# EAGLE design Motee (EAGLE 8.4.1)
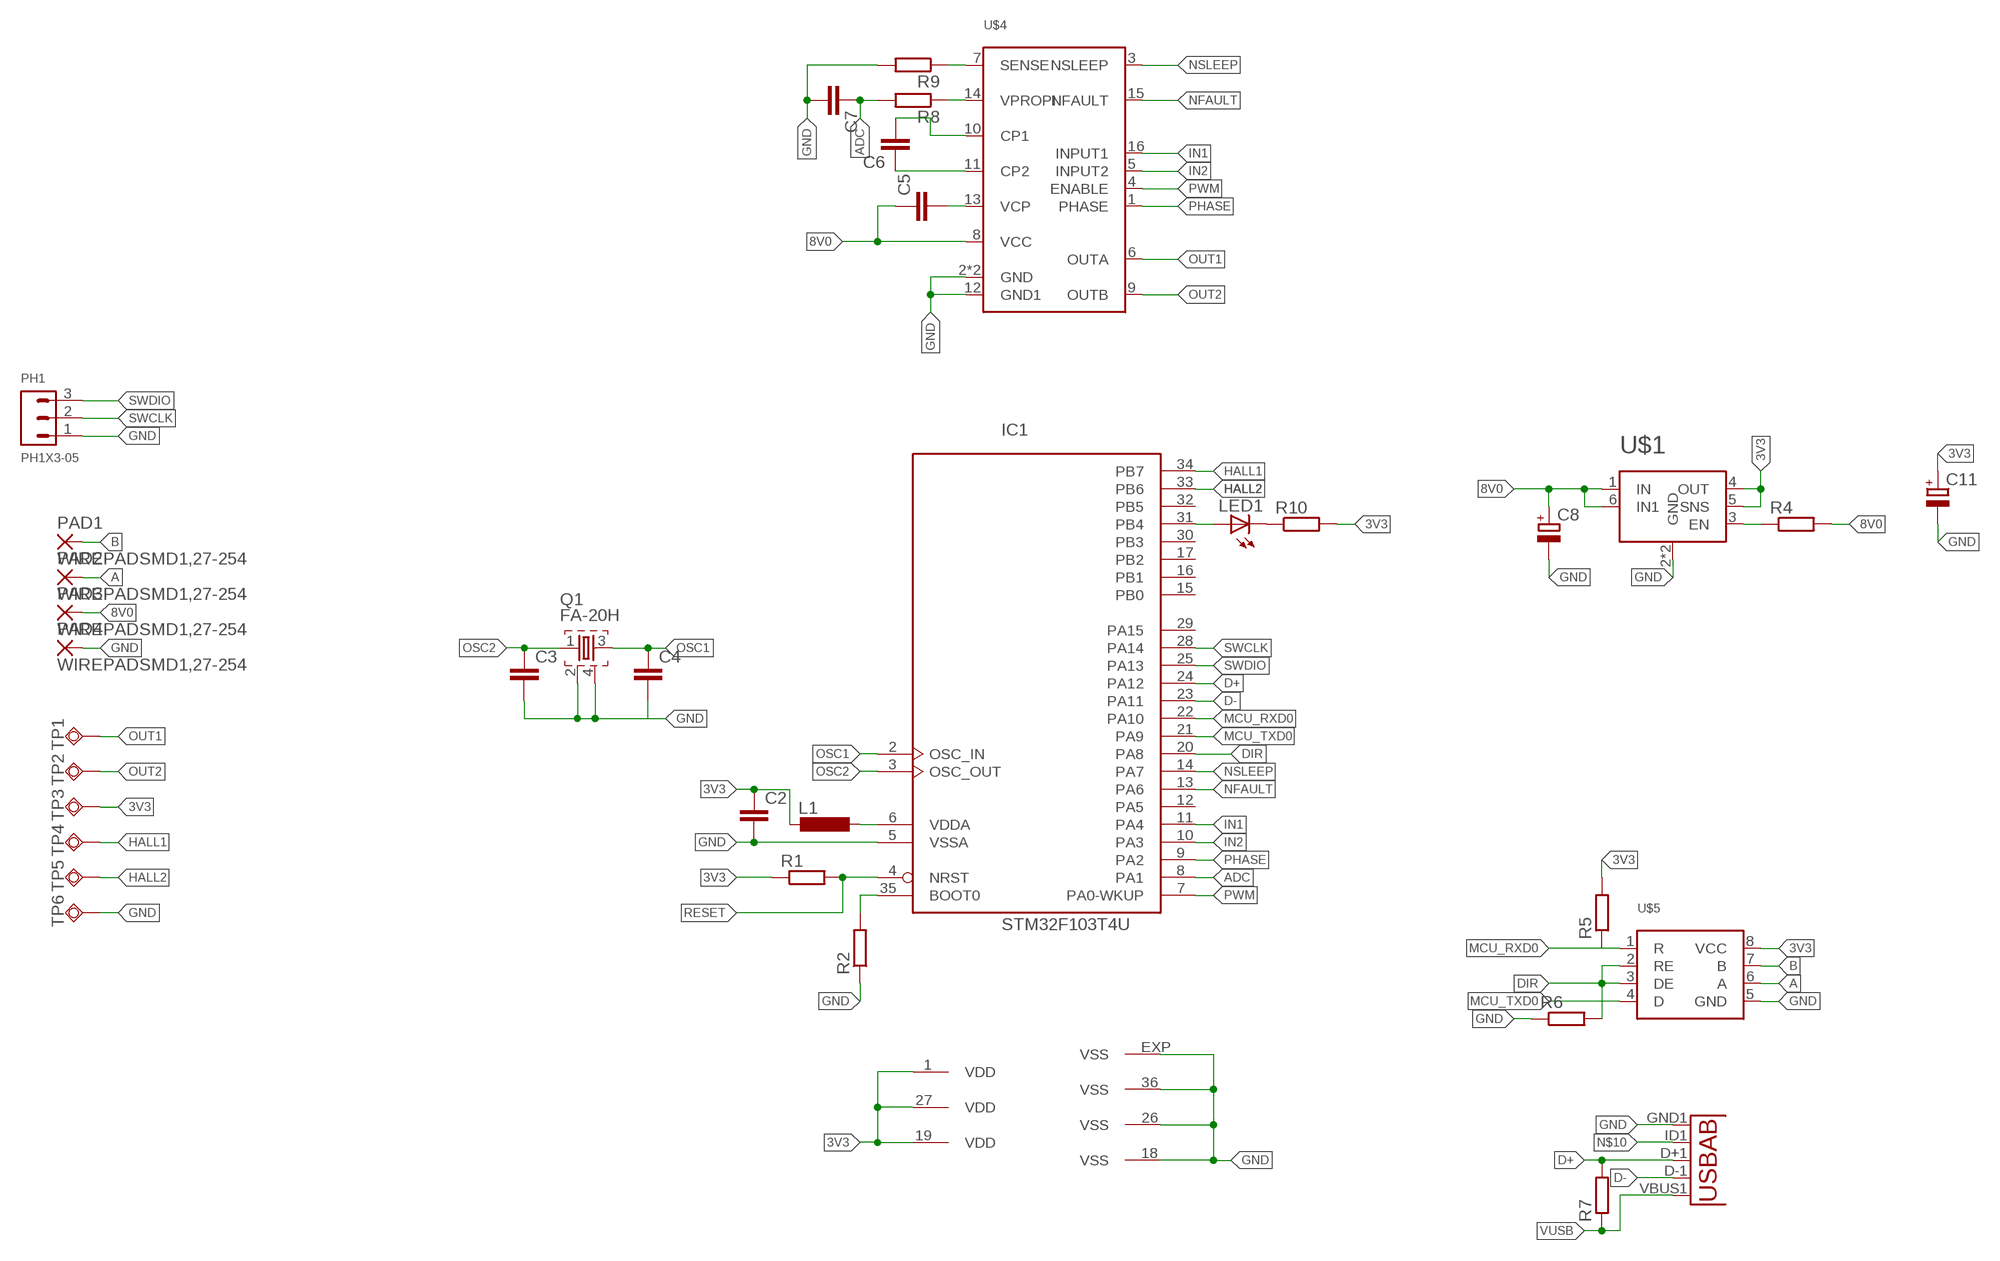
[diagram p0: schematic, sheet 1]

## Parts
C2  C-EUC0402K  [C0402K]
C3  C-EUC0402K  [C0402K]
C4  C-EUC0402K  [C0402K]
C5  C-EUC0402K  [C0402K]
C6  C-EUC0402K  [C0402K]
C7  C-EUC0402K  [C0402K]
C8  CPOL-EUB/3528-21R  [B/3528-21R]
C11  CPOL-EUB/3528-21R  [B/3528-21R]
IC1  STM32F103T4U  [VFQFPN36]
L1  L-EUL2012C  [L2012C]
LED1  LEDCHIP-LED0603  [CHIP-LED0603]
PAD1  WIREPADSMD1,27-254  [SMD1,27-2,54]
PAD2  WIREPADSMD1,27-254  [SMD1,27-2,54]
PAD3  WIREPADSMD1,27-254  [SMD1,27-2,54]
PAD4  WIREPADSMD1,27-254  [SMD1,27-2,54]
PH1  PH1X3-05  [PH005-1-3]
Q1  FA-20H  [FA-20H]
R1  R-EU_R0402  [R0402]
R2  R-EU_R0402  [R0402]
R4  R-EU_R0402  [R0402]
R5  R-EU_R0402  [R0402]
R6  R-EU_R0402  [R0402]
R7  R-EU_R0402  [R0402]
R8  R-EU_R0402  [R0402]
R9  R-EU_R0402  [R0402]
R10  R-EU_R0402  [R0402]
TP1  TPSQTP20SQ  [TP20SQ]
TP2  TPSQTP20SQ  [TP20SQ]
TP3  TPSQTP20SQ  [TP20SQ]
TP4  TPSQTP20SQ  [TP20SQ]
TP5  TPSQTP20SQ  [TP20SQ]
TP6  TPSQTP20SQ  [TP20SQ]
U1  USB""  [USB-MICRO-SMD]
U$1  LP38693  [LP38693]
U$4  DRV8801  [WQFN-16]
U$5  MAX22501EATA  [TDFN-8]

## Nets
3V3: C2.1 C11.+ IC1.1(VDD) IC1.19(VDD) IC1.27(VDD) L1.2 R1.1 R5.2 R10.2 TP3.TP U$1.4(OUT) U$1.5(SNS) U$5.8(VCC)
8V0: C5.1 C8.+ PAD3.1(P) R4.2 U$1.1(IN) U$1.6(IN1) U$4.8(VCC)
A: PAD2.1(P) U$5.6(A)
ADC: C7.1 IC1.8(PA1) R8.2
B: PAD1.1(P) U$5.7(B)
D+: IC1.24(PA12) R7.2 U1.D+1(D+)
D-: IC1.23(PA11) U1.D-1(D-)
DIR: IC1.20(PA8) R6.2 U$5.2(RE) U$5.3(DE)
GND: C2.2 C3.2 C4.2 C7.2 C8.- C11.- IC1.5(VSSA) IC1.18(VSS) IC1.26(VSS) IC1.36(VSS) IC1.EXP(VSS) PAD4.1(P) PH1.1 Q1.2 Q1.4 R2.1 R6.1 R9.2 TP6.TP U1.GND1(GND) U$1.2(GND) U$1.7(GND) U$4.2(GND) U$4.12(GND1) U$4.17(GND) U$5.5(GND)
HALL1: IC1.34(PB7) TP4.TP
HALL2: IC1.33(PB6) TP5.TP
IN1: IC1.11(PA4) U$4.16(INPUT1)
IN2: IC1.10(PA3) U$4.5(INPUT2)
MCU_RXD0: IC1.22(PA10) R5.1 U$5.1(R)
MCU_TXD0: IC1.21(PA9) U$5.4(D)
N$1: IC1.35(BOOT0) R2.2
N$2: IC1.6(VDDA) L1.1
N$3: C6.1 U$4.11(CP2)
N$4: C5.2 U$4.13(VCP)
N$8: C6.2 U$4.10(CP1)
N$9: R4.1 U$1.3(EN)
N$10: U1.ID1(USBID)
N$11: R8.1 U$4.14(VPROPI)
N$12: R9.1 U$4.7(SENSE)
N$13: LED1.C R10.1
N$17: IC1.31(PB4) LED1.A
NFAULT: IC1.13(PA6) U$4.15(NFAULT)
NSLEEP: IC1.14(PA7) U$4.3(NSLEEP)
OSC1: C4.1 IC1.2(OSC_IN) Q1.3
OSC2: C3.1 IC1.3(OSC_OUT) Q1.1
OUT1: TP1.TP U$4.6(OUTA)
OUT2: TP2.TP U$4.9(OUTB)
PHASE: IC1.9(PA2) U$4.1(PHASE)
PWM: IC1.7(PA0-WKUP) U$4.4(ENABLE)
RESET: IC1.4(NRST) R1.2
SWCLK: IC1.28(PA14) PH1.2
SWDIO: IC1.25(PA13) PH1.3
VUSB: R7.1 U1.VBUS1(VBUS)
Unconnected: IC1.12(PA5) IC1.15(PB0) IC1.16(PB1) IC1.17(PB2) IC1.29(PA15) IC1.30(PB3) IC1.32(PB5)

## Library data of the parts
C2-C7 = rcl:C-EU: CAPACITOR, European symbol
C8 C11 = rcl:CPOL-EU: POLARIZED CAPACITOR, European symbol
IC1 = micro-stm_v3:STM32F103T*U: ARM 32-bit Cortex™-M3 CPU 72 MHz maximum frequency 16 to 128 Kbytes of Flash memory 6 to 20 kbytes of SRAM 26 GPIOs 2.0 to 3.6 V application supply
L1 = rcl:L-EU: INDUCTOR, European symbol
LED1 = led:LED: LED OSRAM: - CHIPLED LG R971, LG N971, LY N971, LG Q971, LY Q971, LO R971, LY R971 LH N974, LH R974 LS Q976, LO Q976, LY Q976 LO Q996 - Hyper CHIPLED LW Q18S LB Q993, LB Q99A, LB R99A - SideLED LS A670, LO A670, LY A670, LG A670, LP A670 LB A673, LV A673, LT A673, LW A673 LH A674 LY A675 LS A676, LA A676, LO A676, LY A676, LW A676 LS A679, LY A679, LG A679 - Hyper Micro SIDELED® LS Y876, LA Y876, LO Y876, LY Y876 LT Y87S - SmartLED LW L88C, LW L88S LB L89C, LB L89S, LG L890 LS L89K, LO L89K, LY L89K LS L896, LA L896, LO L896, LY L896 - TOPLED LS T670, LO T670, LY T670, LG T670, LP T670 LSG T670, LSP T670, LSY T670, LOP T670, LYG T670 LG T671, LOG T671, LSG T671 LB T673, LV T673, LT T673, LW T673 LH T674 LS T676, LA T676, LO T676, LY T676, LB T676, LH T676, LSB T676, LW T676 LB T67C, LV T67C, LT T67C, LS T67K, LO T67K, LY T67K, LW E67C LS E67B, LA E67B, LO E67B, LY E67B, LB E67C, LV E67C, LT E67C LW T67C LS T679, LY T679, LG T679 LS T770, LO T770, LY T770, LG T770, LP T770 LB T773, LV T773, LT T773, LW T773 LH T774 LS E675, LA E675, LY E675, LS T675 LS T776, LA T776, LO T776, LY T776, LB T776 LHGB T686 LT T68C, LB T68C - Hyper Mini TOPLED® LB M676 - Mini TOPLED Santana® LG M470 LS M47K, LO M47K, LY M47K Source: http://www.osram.convergy.de LUXEON: - LUMILED® LXK2-PW12-R00, LXK2-PW12-S00, LXK2-PW14-U00, LXK2-PW14-V00 LXK2-PM12-R00, LXK2-PM12-S00, LXK2-PM14-U00 LXK2-PE12-Q00, LXK2-PE12-R00, LXK2-PE12-S00, LXK2-PE14-T00, LXK2-PE14-U00 LXK2-PB12-K00, LXK2-PB12-L00, LXK2-PB12-M00, LXK2-PB14-N00, LXK2-PB14-P00, LXK2-PB14-Q00 LXK2-PR12-L00, LXK2-PR12-M00, LXK2-PR14-Q00, LXK2-PR14-R00 LXK2-PD12-Q00, LXK2-PD12-R00, LXK2-PD12-S00 LXK2-PH12-R00, LXK2-PH12-S00 LXK2-PL12-P00, LXK2-PL12-Q00, LXK2-PL12-R00 Source: www.luxeon.com KINGBRIGHT: KA-3528ASYC Source: www.kingbright.com
PAD1-PAD4 = wirepad:WIREPAD: Wire PAD connect wire on PCB
PH1 = pinhead_1mm:PH1X3
Q1 = crystal:FA-: MHz RANGE CRYSTAL UNIT Source: Epson Toyocom
R1 R2 R4-R10 = rcl:R-EU_: RESISTOR, European symbol
TP1-TP6 = testpad:TPSQ: Test pad
U1 = microusb2:USB: This is a USB AB connector that is compatible with USB OTG. i.e. this connector can serve as a host or device
U$1 = LP38963:LP38693
U$4 = drv8801:DRV8801
U$5 = MAX22501EATA:MAX22501EATA

## Board
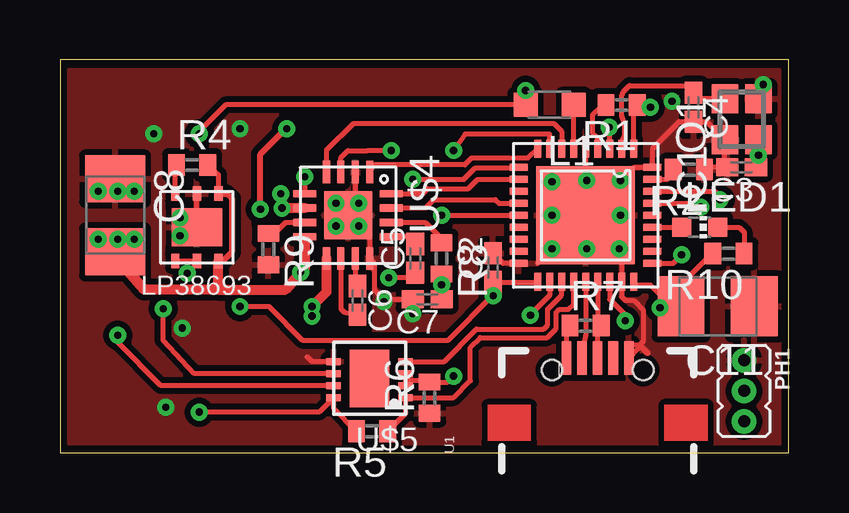
[diagram p1: board, top side]
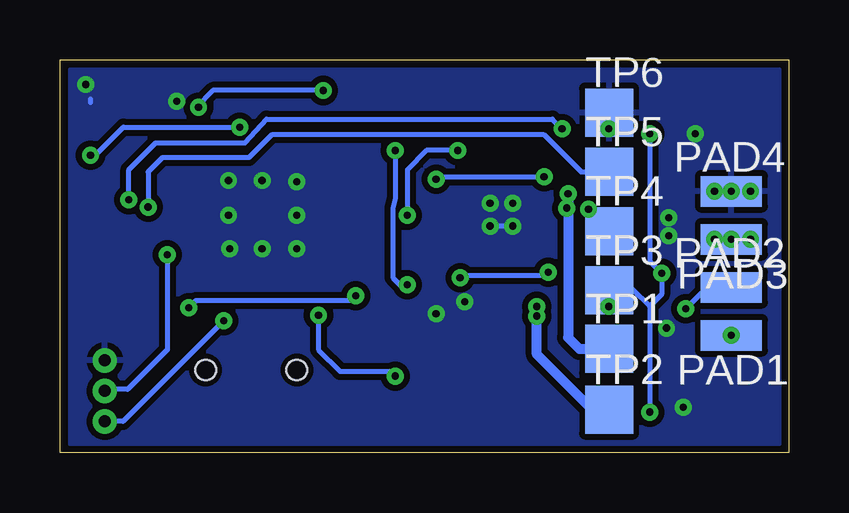
[diagram p2: board, bottom side, seen from below]

Size 30.37 x 16.37 mm. Coordinates in mm from the lower left corner, seen from the top.
Outline: 0,0 30.37,0 30.37,16.37 0,16.37 0,0
Copper layers (1*16): Top 0.035mm / dielectric 1.5mm / Bottom 0.035mm
Design rules "default *": minimum track width 6mil, minimum drill 0.35mm, track to track 6mil, track to pad 5mil, pad to pad 5mil, via to via 0mil, smd to smd 0mil, copper to edge 0mil, drill to drill 6mil, minimum pad ring 10mil, minimum via ring 8mil, stop-mask expansion 4mil, vias tented up to drill 0mil, thermal gap 10mil

### Footprints (pad centres in the part's own frame; a part is rotated, then mirrored left to right if it is on the bottom)
C0402K = smd 0.925 x 0.74: 1 -0.6,0; 2 0.6,0
B/3528-21R = smd 1.95 x 2.5: + 1.525,0; - -1.525,0
VFQFPN36 = smd 0.75 x 0.3: 1 -2.78,2; 2 -2.78,1.5; 3 -2.78,1; 4 -2.78,0.5; 5 -2.78,0; 6 -2.78,-0.5; 7 -2.78,-1; 8 -2.78,-1.5; 9 -2.78,-2; 19 2.78,-2; 20 2.78,-1.5; 21 2.78,-1; 22 2.78,-0.5; 23 2.78,0; 24 2.78,0.5; 25 2.78,1; 26 2.78,1.5; 27 2.78,2 | smd 0.3 x 0.75: 10 -2,-2.78; 11 -1.5,-2.78; 12 -1,-2.78; 13 -0.5,-2.78; 14 0,-2.78; 15 0.5,-2.78; 16 1,-2.78; 17 1.5,-2.78; 18 2,-2.78; 28 2,2.78; 29 1.5,2.78; 30 1,2.78; 31 0.5,2.78; 32 0,2.78; 33 -0.5,2.78; 34 -1,2.78; 35 -1.5,2.78; 36 -2,2.78 | smd 4.1 x 4.1: EXP 0,0
L2012C = smd 1 x 1: 1 -1,0; 2 1,0
CHIP-LED0603 = smd 0.8 x 0.8: A 0,-0.75; C 0,0.75
SMD1,27-2,54 = smd 1.27 x 2.54: 1 0,0
PH005-1-3 = drill 0.5 pad 0.9: 1 0,0; 2 1.27,0; 3 2.54,0
FA-20H = smd 1.2 x 1.1: 1 -0.85,-0.7; 2 0.85,-0.7; 3 0.85,0.7; 4 -0.85,0.7
R0402 = smd 0.7 x 0.9: 1 -0.65,0; 2 0.65,0
TP20SQ = smd 2 x 2: TP 0,0
USB-MICRO-SMD = smd 1.4 x 0.4: D+1 2.7,0; D-1 2.7,0.65; GND1 2.7,-1.3; ID1 2.7,-0.65; VBUS1 2.7,1.3 | hole 0.85: 2.2,1.9; 2.2,-1.9
LP38693 = smd 0.35 x 0.6: 1 -0.9,-1.4; 2 0,-1.4; 3 0.9,-1.4; 4 0.9,1.4; 5 0,1.4; 6 -0.9,1.4 | smd 2.1 x 1.6: 7 0,0
WQFN-16 = smd 0.95 x 0.3: 1 -1.8,0.9; 2 -1.8,0.3; 3 -1.8,-0.3; 4 -1.8,-0.9; 9 1.8,-0.9; 10 1.8,-0.3; 11 1.8,0.3; 12 1.8,0.9 | smd 0.3 x 0.95: 5 -0.9,-1.8; 6 -0.3,-1.8; 7 0.3,-1.8; 8 0.9,-1.8; 13 0.9,1.8; 14 0.3,1.8; 15 -0.3,1.8; 16 -0.9,1.8 | smd 2 x 2: 17 0,0
TDFN-8 = smd 0.61 x 0.305: 1 -1.5,0.8; 2 -1.5,0.3; 3 -1.5,-0.2; 4 -1.5,-0.7; 5 1.5,-0.7; 6 1.5,-0.2; 7 1.5,0.3; 8 1.5,0.8 | smd 1.64 x 2.38: P$1 0,0

### Placement (x,y rotation side)
C2  18.04,7.72 90 top
C3  28.4,11.9 180 top
C4  26.4,14.4 270 top
C5  14.8,8.1 90 top
C6  12.4,6.35 270 top
C7  15.3,6.4 180 top
C8  2.3,9.9 270 top
C11  27.4,6.1 180 top
IC1  21.9,9.9 270 top
L1  20.4,14.5 180 top
LED1  26.65,9.4 270 top
PAD1  2.4,4.9 90 bottom
PAD2  2.4,6.9 270 bottom
PAD3  2.4,8.9 90 bottom
PAD4  2.4,10.9 270 bottom
PH1  28.5,3.85 270 top
Q1  28.4,13.9 90 top
R1  23.4,14.5 180 top
R2  26.2,11.8 180 top
R4  5.5,12 0 top
R5  13,0.9 180 top
R6  15.4,2.3 90 top
R7  21.9,5.3 0 top
R8  15.9,8.1 270 top
R9  8.68,8.49 270 top
R10  27.85,8.3 180 top
TP1  7.49,4.33 0 bottom
TP2  7.49,1.8 0 bottom
TP3  7.49,6.77 0 bottom
TP4  7.49,9.24 0 bottom
TP5  7.49,11.71 0 bottom
TP6  7.49,14.18 0 bottom
U1  22.4,1.25 90 top
U$1  5.7,9.4 180 top
U$4  12,9.9 270 top
U$5  12.9,3.1 180 top

### Tracks (layer width: path | path; a pad name or v marks a point on that pad's centre or on a via)
3V3  (via drill 0.3)
  Top 0.2: R5.2 11.4,1.85 U$5.8 10.8,1.7 v5.8,1.7 | U$1.4 U$1.5 5.7,7.88 v5.3,7.48 | L1.2 6.9,14.5 5.8,13.4 v5.8,13.3 | 8.65,6.1 8.7,6.1 10.1,4.7 16.18,4.7 v18.04,6.56
  Top 0.203: IC1.1 23.9,14.25 R1.1 v24.6,14.4 | v19.4,15.1 L1.2 | IC1.27 24.02,7 24.6,7 25.5,6.1 C11.+ | R10.2 27.15,8.3 26.25,7.4 26.25,6.48 C11.+ | C11.+ 24.85,6.1 v25,6.05 | IC1.19 C2.1 v18.04,6.56 v18.05,6.55 | v7.5,6.1 8.65,6.1
  Bottom 0.2: 5.8,6.1 v5.8,1.7 | 5.8,6.1 6.5,6.8 7.46,6.8 TP3.TP | 5.8,6.1 5.3,6.6 v5.3,7.48 5.8,7.98 v5.8,13.3
  Bottom 0.203: v19.4,15.1 24,15.1 24.7,14.4 v24.6,14.4 | TP3.TP v7.49,6.11 v7.5,6.1 | v25,6.05 24.7,6.35 18.3,6.35 18.05,6.6 v18.05,6.55
8V0  (via drill 0.3)
  Top 0.203: C5.1 14.6,7.3 v13.7,7.3 | U$1.1 6.6,11.6 6.55,11.6 R4.2
  Top 0.254: U$1.6 6.8,8 7.15,8.35 7.15,10.6 6.95,10.8 U$1.1
  Top 0.305: U$4.8 10.2,8.8
  Top 0.406: v1.6,8.9 1.77,8.9 C8.+ 2.3,8.2 3.5,6.8 6.6,6.8 | PAD3.1 v3.1,8.9 | 6.6,6.8 9.4,6.8 v10.03,7.53 10.2,7.7 10.2,8.8 | 6.6,6.8 U$1.6
  Bottom 0.203: v13.7,7.3 13.6,7.4 10.2,7.4 10.2,7.53 v10.03,7.53
  Bottom 0.406: v1.6,8.9 PAD3.1
  other vias: 2.4,8.9
A  (via drill 0.3)
  Top 0.2: U$5.6 5.6,3.3 4.3,4.7 v4.3,6
  Bottom 0.2: v4.3,6 3.4,6.9 PAD2.1
ADC  (via drill 0.3)
  Top 0.203: C7.1 v15.9,7 R8.2 | 16.29,12.51 16.5,12.6 v16.4,12.6 16.88,13.28 20.4,13.28 IC1.8
  Bottom 0.203: v16.4,12.6 16.4,10.6 16.5,10.2 16.5,7.3 16.1,6.9 16,6.9 v15.9,7
B  (via drill 0.3)
  Top 0.2: U$5.7 4.2,2.8 2.4,4.6 PAD1.1
  other vias: 2.4,4.9
D+
  Top 0.203: U1.D+1 22.4,5.25 22.52,5.38 | 22.52,5.38 R7.2 | IC1.24 22.4,5.5 22.52,5.38
D-
  Top 0.203: IC1.23 21.9,4.9 21.8,4.5 21.8,4.15 U1.D-1
DIR  (via drill 0.3)
  Top 0.2: 14.4,3 U$5.2 | 14.4,3 U$5.3 | IC1.20 20.4,6.57 19.53,5.7 19.6,5.7 19.63,5.73 v19.6,5.73 | 14.4,3 15.35,3 R6.2 16.15,2.95 v16.4,3.2
  Bottom 0.2: v19.6,5.73 19.6,4.3 18.7,3.4 16.6,3.4 v16.4,3.2
GND  (via drill 0.3)
  Top 0.2: U$5.5 10.5,3.8 10.3,4
  Top 0.203: 22,10 IC1.EXP | 22,10 23.9,11.9 IC1.36 24.7,11.92 24.7,12.7 25.8,13.8 C4.2 26.95,13.8 Q1.4 27.7,11.9 | R2.1 26.95,11.9 27.7,11.9 | 27.7,11.9 C3.2 | 19.9,7.9 IC1.EXP | 22,10 23.4,8.6 IC1.26 23.4,6.5 23.55,6.35 23.9,6.35 24.3,5.95 24.3,4.65 24.15,4.5 | IC1.EXP IC1.5 | U$4.17 v12.45,9.45 12.9,9 U$4.12 13.1,7.9 13.1,6.8 13.5,6.4 C7.2 | 5.7,9.5 U$1.7 | 5.7,9.5 U$1.2 | 6.62,9.02 6.6,9 6.2,9 5.7,9.5 | U$4.17 v11.5,10.4 11.35,10.55 | U$4.17 11.8,9.9 v11.5,9.45 | U$4.17 12.3,10.2 v12.45,10.4 12.3,10.55 U$4.2 | 24.15,4.5 24.5,4.15 24.45,4.15 24.25,4.35 24.1,4.35 U1.GND1 23.7,4.45 23.65,4.5 24.15,4.5 | C2.2 18.46,7.9 IC1.18
  Top 0.406: v1.6,10.9 PAD4.1
  Bottom 0.203: Q1.2 29.1,14.6 | 11.45,9.55 v11.5,9.45 v12.45,9.45
  Bottom 0.406: v3.1,10.9 PAD4.1 v1.6,10.9
  other vias: 2.4,10.9 14.7,5.8 13.5,6.3 5,9.8 5,9.05 20.5,11.3 20.5,8.5 23.3,8.5 23.35,11.35 20.5,9.9 21.95,11.35 23.35,9.9 21.95,8.5 7.5,13.5 25.5,14.65 29.3,15.35 5.1,5.2 3.9,13.3 4.4,1.9
  pour Top (isolate 0.254): 0.4,15.95 29.95,15.95 29.95,0.4 0.4,0.4
  pour Bottom (isolate 0.254): 0.4,15.95 29.95,15.95 29.95,0.4 0.4,0.4
HALL1  (via drill 0.3)
  Top 0.203: IC1.34 27.3,10.9 27.55,10.55 v27.5,10.55 | 9.35,13.6 9.28,13.53 9.42,13.51 v9.45,13.5
  Top 0.254: v8.35,10.15 8.35,12.44 9.42,13.51
  Bottom 0.203: v27.5,10.55 27.5,11.8 26.39,12.91 22.65,12.91 21.76,13.91 9.86,13.91 v9.45,13.5 | v8.35,10.15 7.49,9.49 TP4.TP
HALL2  (via drill 0.3)
  Top 0.203: IC1.33 26.65,10.4 26.7,10.35 v26.7,10.24
  Bottom 0.2: 10.2,13.25 21.55,13.25 22.5,12.3 26.1,12.3 26.69,11.71 26.69,10.26
  Bottom 0.203: v26.7,10.24 26.69,10.26 26.65,10.39 | 10.2,13.25 8.66,11.71 TP5.TP
IN1
  Top 0.203: IC1.11 17.4,11.4 17.01,11.01 15.32,11.01 15.11,10.8 U$4.16
IN2  (via drill 0.3)
  Top 0.203: IC1.10 19,11.88 17.31,11.88 16.83,11.4 v14.7,11.4 | v10.2,11.5 U$4.5
  Bottom 0.203: v14.7,11.4 14.6,11.5 v10.2,11.5
MCU_RXD0
  Top 0.2: IC1.22 21.4,6.2 21.18,5.98 20.81,5.98 20.67,5.84 20.67,5.17 20.3,4.8 17.5,4.8 17.1,4.4 17.1,3 16.4,2.3 U$5.1 14.4,1.65 R5.1
MCU_TXD0
  Top 0.2: U$5.4 16,3.8 17.35,5.15 20.15,5.15 20.32,5.32 20.32,5.99 20.9,6.57 IC1.21
N$1
  Top 0.203: IC1.35 25.3,11.4 25.55,11.65 R2.2
N$2
  Top 0.203: IC1.6 L1.1
N$3
  Top 0.203: U$4.11 12.3,6.9 C6.1
N$4
  Top 0.203: C5.2 14.5,9 U$4.13
N$8
  Top 0.203: U$4.10 11.7,6 11.85,5.85 C6.2
N$9
  Top 0.203: U$1.3 4.8,11.95 R4.1
N$11
  Top 0.203: U$4.14 15.21,9.6 15.9,8.91 R8.1
N$12
  Top 0.203: R9.1 8.89,9.09 9.4,9.6 U$4.7
N$13
  Top 0.203: LED1.C 28.3,9.4 28.5,9.2 R10.1
N$17
  Top 0.203: IC1.31 LED1.A
NFAULT
  Top 0.203: U$4.15 15.21,10.2 15.57,10.56 18.14,10.56 18.3,10.4 18.8,10.4 18.84,10.44 18.88,10.4 IC1.13
NSLEEP  (via drill 0.3)
  Top 0.203: v15.9,9.9 IC1.14 | U$4.3 11.7,12.3 11.99,12.59 12.8,12.59 12.81,12.6 v13.8,12.6
  Bottom 0.203: v15.9,9.9 15.9,11.8 15.1,12.6 v13.8,12.6
OSC1
  Top 0.203: Q1.3 26.65,14.75 C4.1 26.2,15.3 23.73,15.3 23.47,15.04 23.43,14.93 23.4,14.9 23.4,14.04 23.54,13.7 23.54,13.24 23.4,13 IC1.2
OSC2  (via drill 0.3)
  Top 0.203: IC1.3 22.9,13.5 22.97,13.47 v22.88,13.57 | Q1.1 v29.1,12.4 29,12.3 C3.1
  Bottom 0.203: v22.88,13.57 27.73,13.57 28.9,12.4 v29.1,12.4
OUT1  (via drill 0.3)
  Top 0.406: U$4.6 v9.25,10.2 | 9.35,10.25 v9.25,10.2 | v9.25,10.2 9.25,10.75 v9.2,10.8
  Bottom 0.406: v9.2,10.8 9.2,4.8 8.73,4.33 TP1.TP
OUT2  (via drill 0.3)
  Top 0.406: U$4.9 11.1,6.7 v10.5,6.1
  Bottom 0.406: v10.5,6.1 v10.5,5.7 10.5,4.1 8.2,1.8 TP2.TP
PHASE
  Top 0.203: IC1.9 19.5,12.28 17.14,12.28 16.87,12 13.1,12 U$4.1
PWM
  Top 0.203: IC1.7 20.9,13.4 20.57,13.73 12.23,13.73 11.1,12.6 U$4.4
RESET
  Top 0.203: IC1.4 22.4,13.1 22.2,13.3 22.2,14.1 22.5,14.4 R1.2
SWCLK  (via drill 0.3)
  Top 0.203: IC1.28 25.55,7.9 v25.9,8.25
  Bottom 0.203: v25.9,8.25 25.9,4.3 27.55,2.65 28.43,2.65 PH1.2
SWDIO  (via drill 0.3)
  Top 0.203: IC1.25 22.9,6.4 23.55,5.75 v23.55,5.5
  Bottom 0.203: v23.55,5.5 27.74,1.31 PH1.3
VUSB
  Top 0.203: R7.1 21.1,5.25 U1.VBUS1